# EAGLE design RxT6 (EAGLE 4.13)
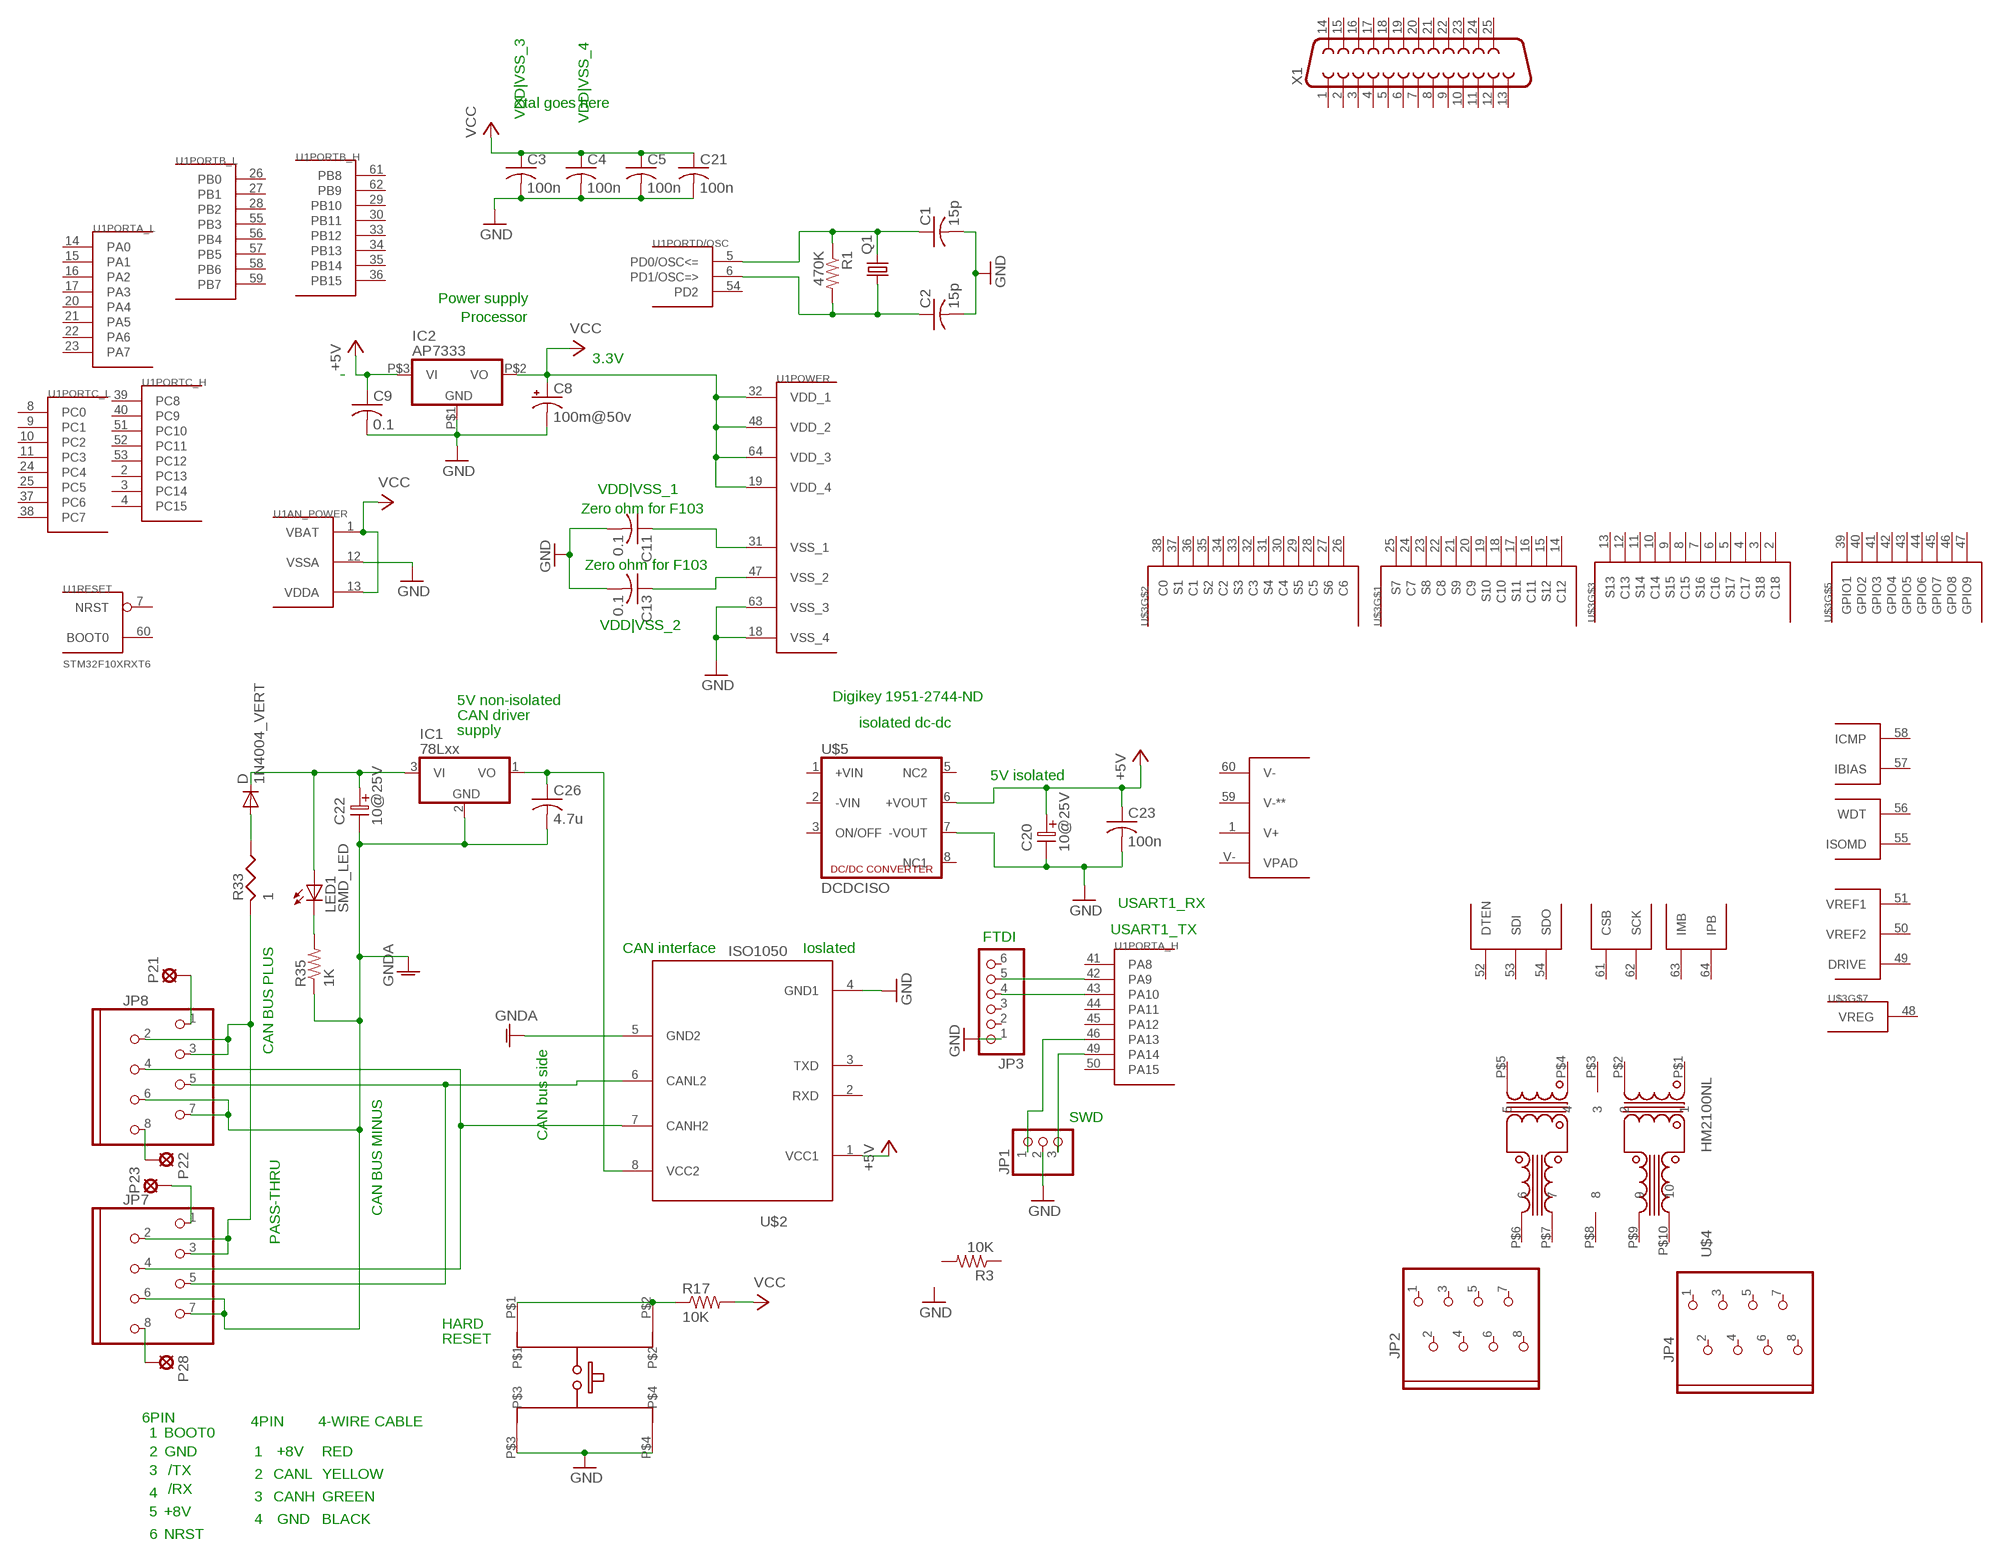
[diagram p0: schematic, sheet 1]

## Parts
C1  15p  C-USC0603  [C0603]
C2  15p  C-USC0603  [C0603]
C3  100n  C-USC0603  [C0603]
C4  100n  C-USC0603  [C0603]
C5  100n  C-USC0603  [C0603]
C8  100m@50v  CPOL-USE5-8.5  [E5-8,5]
C9  0.1  C-USC0603  [C0603]
C11  0.1  C-USC0603  [C0603]
C13  0.1  C-USC0603  [C0603]
C20  10@25V  ELC-2,5L  [ES-2,5L]
C21  100n  C-USC0603  [C0603]
C22  10@25V  ELC-2,5L  [ES-2,5L]
C23  100n  C-USC0603  [C0603]
C26  4.7u  C-USC0603  [C0603]
D  1N4004_VERT  [DO41-10_VERT]
IC1  78Lxx  7805L  [TO92]
IC2  AP7333  MCP1702  [SOT-23A]
JP1  PINHD-1X3  [1X03]
JP2  MOD8P8C  [MOD8P8C]
JP3  PINHD-1X6  [1X06]
JP4  MOD8P8C  [MOD8P8C]
JP7  MOD8P8C  [MOD8P8C]
JP8  MOD8P8C  [MOD8P8C]
LED1  SMD_LED  [SMD_LED]
P21  SOLPAD035  [SOLDPAD035]
P22  SOLPAD035  [SOLDPAD035]
P23  SOLPAD035  [SOLDPAD035]
P28  SOLPAD035  [SOLDPAD035]
Q1  CRYTALHC49S  [HC49/S]
R1  470K  R-US_R0603  [R0603]
R3  10K  R-US_R0603  [R0603]
R17  10K  R-US_R0603  [R0603]
R33  1  RESUS-S2,5  [RS-2,5]
R35  1K  R-US_R0603  [R0603]
SW1  E-SWITCH  [E-SWITCH]
U1  STM32F10XRXT6  [TQFP64]
U$2  ISO1050  [PDSO-G8]
U$3  LTC6813  [TQFP64_PAD]
U$4  HM2100NL  [PULSE]
U$5  DCDCISO  [DCDC7PIN]
X1  F25HP  [F25HP]

## Nets
+5V: C9.1 C20.1 C23.1 IC2.P$3(VI) U$2.1(VCC1) U$5.6(+VOUT)
+12V_RESISTORED: D.A R33.1
CAN_PROTECTED+: C22.1 D.C IC1.3(VI) LED1.A
CAN_RAW_PLUS: JP7.2 JP7.3 JP8.2 JP8.3 R33.2
CANCABLE_1_1: JP8.1 P21.MP
CANCABLE_1_8: JP8.8 P22.MP
CANCABLE_2_1: JP7.1 P23.MP
CANCABLE_2_8: JP7.8 P28.MP
CANH: JP7.4 JP8.4 U$2.7(CANH2)
CANL: JP7.5 JP8.5 U$2.6(CANL2)
GND: C1.2 C2.2 C3.2 C4.2 C5.2 C8.- C9.2 C11.2 C13.2 C20.2 C21.2 C23.2 IC2.P$1(GND) JP1.2 JP3.1 SW1.P$3 SW1.P$4 U1.12(AN_POWER:VSSA) U1.18(POWER:VSS_4) U1.63(POWER:VSS_3) U$2.4(GND1) U$5.7(-VOUT)
GNDA: C22.2 C26.2 IC1.2(GND) JP7.6 JP7.7 JP8.6 JP8.7 R35.1 U$2.5(GND2)
ISO_PLUS: C26.1 IC1.1(VO) U$2.8(VCC2)
JTCK: JP1.3 U1.49(PORTA_H:PA14)
JTMS: JP1.1 U1.46(PORTA_H:PA13)
LED_BUS_PWR: LED1.C R35.2
NRST: R17.1 SW1.P$1 SW1.P$2
PA9_USART1_TX: JP3.5 U1.42(PORTA_H:PA9)
PA10_USART1_RX: JP3.4 U1.43(PORTA_H:PA10)
PD0_OSC_IN_XTAL: C1.1 Q1.2 R1.1 U1.5(PORTD/OSC:PD0/OSC<=)
PD1_OSC_OUT: C2.1 Q1.1 R1.2 U1.6(PORTD/OSC:PD1/OSC=>)
VCC: C3.1 C4.1 C5.1 C8.+ C21.1 IC2.P$2(VO) R17.2 U1.1(AN_POWER:VBAT) U1.13(AN_POWER:VDDA) U1.19(POWER:VDD_4) U1.32(POWER:VDD_1) U1.48(POWER:VDD_2) U1.64(POWER:VDD_3)
VSS_1: C11.1 U1.31(POWER:VSS_1)
VSS_2: C13.1 U1.47(POWER:VSS_2)
Unconnected: JP2.1 JP2.2 JP2.3 JP2.4 JP2.5 JP2.6 JP2.7 JP2.8 JP3.2 JP3.3 JP3.6 JP4.1 JP4.2 JP4.3 JP4.4 JP4.5 JP4.6 JP4.7 JP4.8 R3.1 R3.2 U1.2(PORTC_H:PC13) U1.3(PORTC_H:PC14) U1.4(PORTC_H:PC15) U1.7(RESET:NRST) U1.8(PORTC_L:PC0) U1.9(PORTC_L:PC1) U1.10(PORTC_L:PC2) U1.11(PORTC_L:PC3) U1.14(PORTA_L:PA0) U1.15(PORTA_L:PA1) U1.16(PORTA_L:PA2) U1.17(PORTA_L:PA3) U1.20(PORTA_L:PA4) U1.21(PORTA_L:PA5) U1.22(PORTA_L:PA6) U1.23(PORTA_L:PA7) U1.24(PORTC_L:PC4) U1.25(PORTC_L:PC5) U1.26(PORTB_L:PB0) U1.27(PORTB_L:PB1) U1.28(PORTB_L:PB2) U1.29(PORTB_H:PB10) U1.30(PORTB_H:PB11) U1.33(PORTB_H:PB12) U1.34(PORTB_H:PB13) U1.35(PORTB_H:PB14) U1.36(PORTB_H:PB15) U1.37(PORTC_L:PC6) U1.38(PORTC_L:PC7) U1.39(PORTC_H:PC8) U1.40(PORTC_H:PC9) U1.41(PORTA_H:PA8) U1.44(PORTA_H:PA11) U1.45(PORTA_H:PA12) U1.50(PORTA_H:PA15) U1.51(PORTC_H:PC10) U1.52(PORTC_H:PC11) U1.53(PORTC_H:PC12) U1.54(PORTD/OSC:PD2) U1.55(PORTB_L:PB3) U1.56(PORTB_L:PB4) U1.57(PORTB_L:PB5) U1.58(PORTB_L:PB6) U1.59(PORTB_L:PB7) U1.60(RESET:BOOT0) U1.61(PORTB_H:PB8) U1.62(PORTB_H:PB9) U$2.2(RXD) U$2.3(TXD) U$3.2(C18) U$3.3(S18) U$3.4(C17) U$3.5(S17) U$3.6(C16) U$3.7(S16) U$3.8(C15) U$3.9(S15) U$3.10(C14) U$3.11(S14) U$3.12(C13) U$3.13(S13) U$3.14(C12) U$3.15(S12) U$3.16(C11) U$3.17(S11) U$3.18(C10) U$3.19(S10) U$3.20(C9) U$3.21(S9) U$3.22(C8) U$3.23(S8) U$3.24(C7) U$3.25(S7) U$3.26(C6) U$3.27(S6) U$3.28(C5) U$3.29(S5) U$3.30(C4) U$3.31(S4) U$3.32(C3) U$3.33(S3) U$3.34(C2) U$3.35(S2) U$3.36(C1) U$3.37(S1) U$3.38(C0) U$3.39(GPIO1) U$3.40(GPIO2) U$3.41(GPIO3) U$3.42(GPIO4) U$3.43(GPIO5) U$3.44(GPIO6) U$3.45(GPIO7) U$3.46(GPIO8) U$3.47(GPIO9) U$3.48(VREG) U$3.55(ISOMD) U$3.56(WDT) U$3.57(IBIAS) U$3.58(ICMP) U$3.61(CSB) U$3.62(SCK) U$3.63(IMB) U$3.64(IPB) U$4.P$1 U$4.P$2 U$4.P$3 U$4.P$4 U$4.P$5 U$4.P$6 U$4.P$7 U$4.P$8 U$4.P$9 U$4.P$10 U$5.1(+VIN) U$5.2(-VIN) U$5.3(ON/OFF) U$5.5(NC2) U$5.8(NC1) X1.1 X1.2 X1.3 X1.4 X1.5 X1.6 X1.7 X1.8 X1.9 X1.10 X1.11 X1.12 X1.13 X1.14 X1.15 X1.16 X1.17 X1.18 X1.19 X1.20 X1.21 X1.22 X1.23 X1.24 X1.25

## Notes on the sheet
- Xtal goes here
- VDD|VSS_3 | VDD|VSS_4
- Power supply
- Processor
- 3.3V
- VDD|VSS_1
- Zero ohm for F103
- Zero ohm for F103
- VDD|VSS_2
- 5V non-isolated | Digikey | 1951-2744-ND
- CAN driver
- isolated dc-dc
- supply
- 5V isolated
- USART1_RX
- USART1_TX
- FTDI
- CAN interface | Ioslated
- CAN BUS PLUS
- SWD
- CAN bus side
- PASS-THRU
- CAN BUS MINUS
- HARD
- RESET
- 6PIN | 4PIN | 4-WIRE CABLE
- 1 | BOOT0
- 2 | GND | 1 | +8V | RED
- 3 | /TX | 2 | CANL | YELLOW
- 4 | /RX
- 3 | CANH | GREEN
- 5 | +8V
- 4 | GND | BLACK
- 6 | NRST

## Power pins joined to a net without a drawn wire
DRIVE: U$3.49(DRIVE)
DTEN: U$3.52(DTEN)
SDI: U$3.53(SDI)
SDO: U$3.54(SDO)
V+: U$3.1(V+)
V-: U$3.60(V-)
V-**: U$3.59(V-**)
VPAD: U$3.V-(VPAD)
VREF1: U$3.51(VREF1)
VREF2: U$3.50(VREF2)

## Library data of the parts
C1-C5 C9 C11 C13 C21 C23 C26 = rcl:C-US: CAPACITOR, American symbol
C8 = rcl:CPOL-US: POLARIZED CAPACITOR, American symbol
C20 C22 = DEH:ELC-2,5L
D = diode:1N4004_VERT
IC1 = linear:78*: Positive VOLTAGE REGULATOR
IC2 = linear:MCP1702
JP1 = pinhead:PINHD-1X3: PIN HEADER
JP2 JP4 JP7 JP8 = DEH:MOD8P8C
JP3 = pinhead:PINHD-1X6: PIN HEADER
LED1 = led:SMD_LED
P21-P23 P28 = solpad:SOLPAD035
Q1 = crystal:CRYTAL: CRYSTAL
R1 R3 R17 R35 = rcl:R-US_: RESISTOR, American symbol
R33 = DEH:RESUS-S2,5
SW1 = switch-misc:E-SWITCH
U1 = stm32:STM32F10XRXT6: STM32F101/103 64pin LQFP
U$2 = texas:ISO1050
U$3 = stm32:LTC6813
U$4 = DEH:HM2100NL
U$5 = dc-dc-converter:DCDCISO
X1 = con-subd:F25: SUB-D

## Board
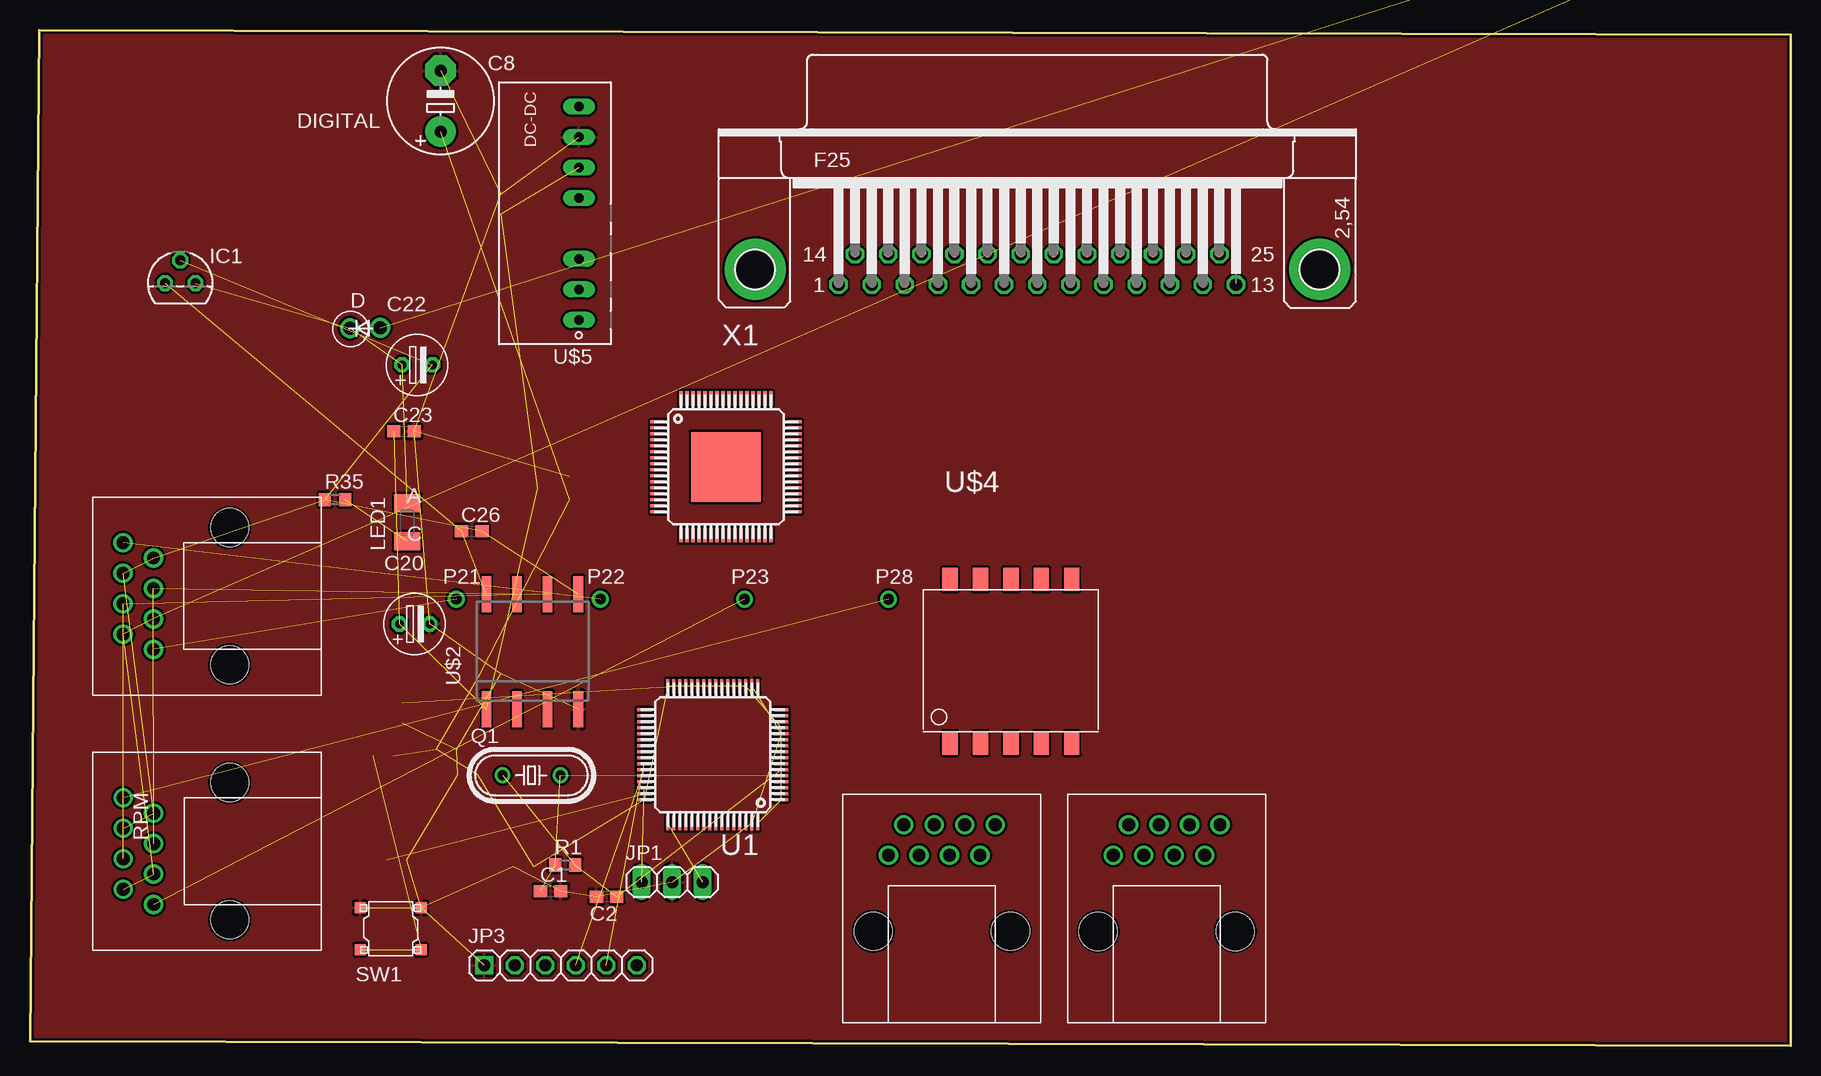
[diagram p1: board, top side]
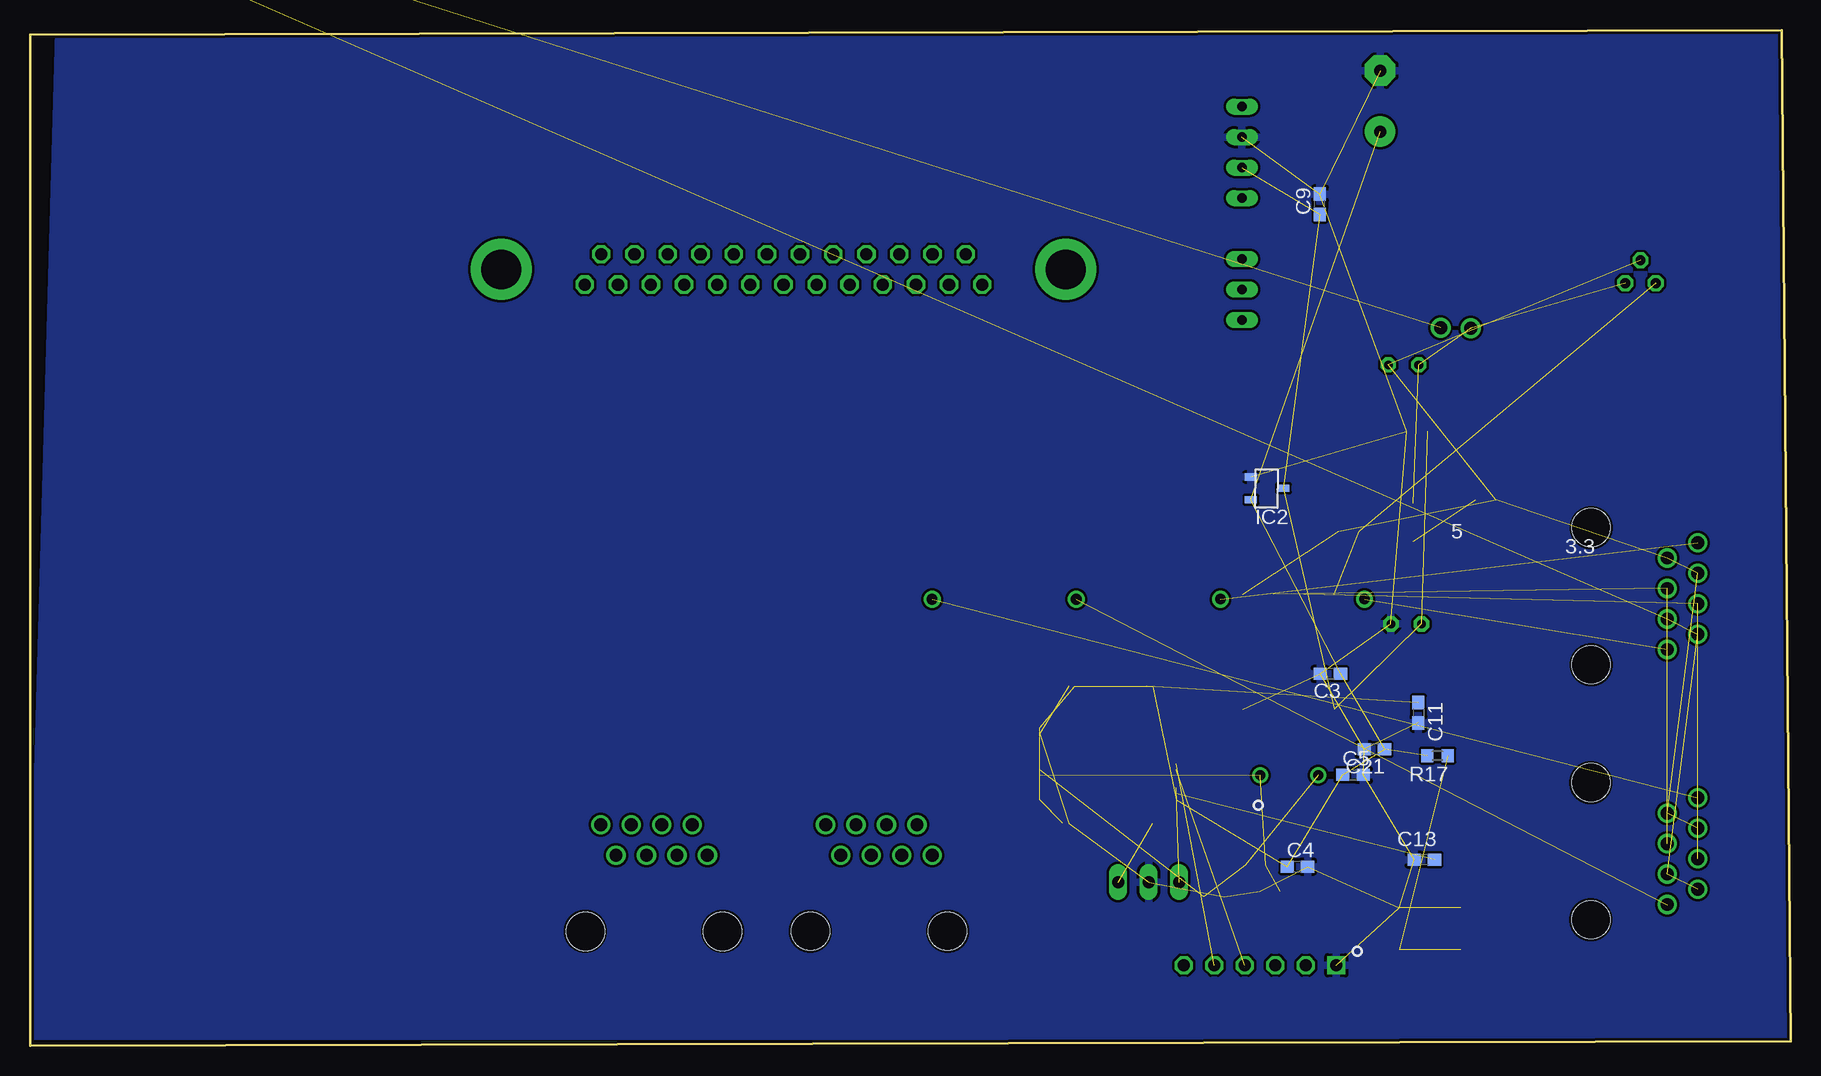
[diagram p2: board, bottom side, seen from below]

Size 146.73 x 84.66 mm. Coordinates in mm from the lower left corner, seen from the top.
Outline: 0,0.38 0.76,84.66 146.73,84.28 146.73,0 0,0.38
Copper layers (1*16): Top 0.035mm / dielectric 1.5mm / Bottom 0.035mm
Design rules "default": minimum track width 8mil, minimum drill 0.6mm, track to track 0.2083mm, track to pad 8mil, pad to pad 8mil, via to via 8mil, smd to smd 0mil, copper to edge 8mil, drill to drill 8mil, minimum pad ring 10mil, minimum via ring 8mil, stop-mask expansion 4mil, vias tented up to drill 0mil, thermal gap 10mil

### Footprints (pad centres in the part's own frame; a part is rotated, then mirrored left to right if it is on the bottom)
C0603 = smd 1.1 x 1: 1 -0.85,0; 2 0.85,0
E5-8,5 = drill 1 pad 2.54 round: + -2.54,0 | drill 1 pad 2.54 octagon: - 2.54,0
ES-2,5L = drill 0.711 pad 1.27 octagon: 1 0,0; 2 2.54,0
DO41-10_VERT = drill 1.1 round: A 2.58,0.05; C 0.07,0
TO92 = drill 0.813 octagon: 1 -1.27,0; 2 0,1.905; 3 1.27,0
SOT-23A = smd 0.6 x 1: P$1 -0.95,-1.35; P$2 0.95,-1.35; P$3 0,1.35
1X03 = drill 1 long: 1 -2.54,0; 2 0,0; 3 2.54,0
MOD8P8C = drill 1.067 pad 1.397 round: 1 -3.81,-2.54; 2 -2.54,0; 3 -1.27,-2.54; 4 0,0; 5 1.27,-2.54; 6 2.54,0; 7 3.81,-2.54; 8 5.08,0 | hole 3.175: -5.08,-8.89; 6.35,-8.89
1X06 = drill 1 square: 1 -6.35,0 | drill 1 octagon: 2 -3.81,0; 3 -1.27,0; 4 1.27,0; 5 3.81,0; 6 6.35,0
SMD_LED = smd 2.2 x 1.5: A 0,1.6; C 0,-1.6
SOLDPAD035 = drill 0.889 pad 1.27 round: MP 0,0
HC49/S = drill 0.813 round: 1 -2.413,0; 2 2.413,0
R0603 = smd 1 x 1.1: 1 -0.85,0; 2 0.85,0
RS-2,5 = drill 0.9 pad 1.6 octagon: 1 0,0; 2 2.54,0
E-SWITCH = smd 0.9 x 0.9: P$1 -2.55,1.75; P$2 2.55,1.75; P$3 -2.55,-1.75; P$4 2.55,-1.75
TQFP64 = smd 1.2 x 0.26: 1 -5.7,3.75; 2 -5.7,3.25; 3 -5.7,2.75; 4 -5.7,2.25; 5 -5.7,1.75; 6 -5.7,1.25; 7 -5.7,0.75; 8 -5.7,0.25; 9 -5.7,-0.25; 10 -5.7,-0.75; 11 -5.7,-1.25; 12 -5.7,-1.75; 13 -5.7,-2.25; 14 -5.7,-2.75; 15 -5.7,-3.25; 16 -5.7,-3.75; 33 5.7,-3.75; 34 5.7,-3.25; 35 5.7,-2.75; 36 5.7,-2.25; 37 5.7,-1.75; 38 5.7,-1.25; 39 5.7,-0.75; 40 5.7,-0.25; 41 5.7,0.25; 42 5.7,0.75; 43 5.7,1.25; 44 5.7,1.75; 45 5.7,2.25; 46 5.7,2.75; 47 5.7,3.25; 48 5.7,3.75 | smd 0.26 x 1.2: 17 -3.75,-5.7; 18 -3.25,-5.7; 19 -2.75,-5.7; 20 -2.25,-5.7; 21 -1.75,-5.7; 22 -1.25,-5.7; 23 -0.75,-5.7; 24 -0.25,-5.7; 25 0.25,-5.7; 26 0.75,-5.7; 27 1.25,-5.7; 28 1.75,-5.7; 29 2.25,-5.7; 30 2.75,-5.7; 31 3.25,-5.7; 32 3.75,-5.7; 49 3.75,5.7; 50 3.25,5.7; 51 2.75,5.7; 52 2.25,5.7; 53 1.75,5.7; 54 1.25,5.7; 55 0.75,5.7; 56 0.25,5.7; 57 -0.25,5.7; 58 -0.75,5.7; 59 -1.25,5.7; 60 -1.75,5.7; 61 -2.25,5.7; 62 -2.75,5.7; 63 -3.25,5.7; 64 -3.75,5.7
PDSO-G8 = smd 0.8 x 3: 1 -3.825,-4.8; 2 -1.275,-4.8; 3 1.265,-4.78; 4 3.825,-4.8; 5 3.825,4.8; 6 1.275,4.8; 7 -1.275,4.81; 8 -3.825,4.81
TQFP64_PAD = smd 1.2 x 0.26: 1 -5.7,3.75; 2 -5.7,3.25; 3 -5.7,2.75; 4 -5.7,2.25; 5 -5.7,1.75; 6 -5.7,1.25; 7 -5.7,0.75; 8 -5.7,0.25; 9 -5.7,-0.25; 10 -5.7,-0.75; 11 -5.7,-1.25; 12 -5.7,-1.75; 13 -5.7,-2.25; 14 -5.7,-2.75; 15 -5.7,-3.25; 16 -5.7,-3.75; 33 5.7,-3.75; 34 5.7,-3.25; 35 5.7,-2.75; 36 5.7,-2.25; 37 5.7,-1.75; 38 5.7,-1.25; 39 5.7,-0.75; 40 5.7,-0.25; 41 5.7,0.25; 42 5.7,0.75; 43 5.7,1.25; 44 5.7,1.75; 45 5.7,2.25; 46 5.7,2.75; 47 5.7,3.25; 48 5.7,3.75 | smd 0.26 x 1.2: 17 -3.75,-5.7; 18 -3.25,-5.7; 19 -2.75,-5.7; 20 -2.25,-5.7; 21 -1.75,-5.7; 22 -1.25,-5.7; 23 -0.75,-5.7; 24 -0.25,-5.7; 25 0.25,-5.7; 26 0.75,-5.7; 27 1.25,-5.7; 28 1.75,-5.7; 29 2.25,-5.7; 30 2.75,-5.7; 31 3.25,-5.7; 32 3.75,-5.7; 49 3.75,5.7; 50 3.25,5.7; 51 2.75,5.7; 52 2.25,5.7; 53 1.75,5.7; 54 1.25,5.7; 55 0.75,5.7; 56 0.25,5.7; 57 -0.25,5.7; 58 -0.75,5.7; 59 -1.25,5.7; 60 -1.75,5.7; 61 -2.25,5.7; 62 -2.75,5.7; 63 -3.25,5.7; 64 -3.75,5.7 | smd 5.8 x 5.8: V- 0,0
PULSE = smd 1.27 x 1.9: P$1 -5.08,-6.78; P$2 -2.54,-6.78; P$3 0,-6.78; P$4 2.54,-6.78; P$5 5.08,-6.78; P$6 5.08,6.88; P$7 2.54,6.88; P$8 0,6.88; P$9 -2.54,6.88; P$10 -5.08,6.88
DCDC7PIN = drill 0.813 long: 1 0,-0.03; 2 2.54,-0.03; 3 5.08,-0.03; 5 10.16,-0.03; 6 12.7,-0.03; 7 15.24,-0.03; 8 17.78,-0.03
F25HP = drill 1.016 octagon: 1 -16.561,-1.27; 2 -13.792,-1.27; 3 -11.049,-1.27; 4 -8.28,-1.27; 5 -5.512,-1.27; 6 -2.769,-1.27; 7 0,-1.27; 8 2.769,-1.27; 9 5.512,-1.27; 10 8.28,-1.27; 11 11.049,-1.27; 12 13.792,-1.27; 13 16.561,-1.27; 14 -15.189,1.27; 15 -12.421,1.27; 16 -9.652,1.27; 17 -6.909,1.27; 18 -4.14,1.27; 19 -1.372,1.27; 20 1.372,1.27; 21 4.14,1.27; 22 6.909,1.27; 23 9.652,1.27; 24 12.421,1.27; 25 15.189,1.27 | drill 3.302 pad 5.08 round: G1 -23.52,0; G2 23.52,0

### Placement (x,y rotation side)
C1  43.39,12.89 0 top
C2  48.05,12.44 180 top
C3  38.37,31 180 bottom
C4  41.12,14.95 0 bottom
C5  36.48,22.58 0 bottom
C8  34.21,78.74 90 top
C9  39.24,70.14 90 bottom
C11  31.03,27.77 270 bottom
C13  30.54,15.53 180 bottom
C20  30.78,35.17 0 top
C21  34.7,24.72 180 bottom
C22  31,56.76 0 top
C23  31.16,51.21 0 top
C26  36.81,42.88 0 top
D  26.6,59.8 0 top
IC1  12.52,63.56 0 top
IC2  43.63,46.47 270 bottom
JP1  53.51,13.65 0 top
JP2  94.09,18.43 0 top
JP3  44.22,6.72 0 top
JP4  75.35,18.44 0 top
JP7  7.76,15.59 90 top
JP8  7.75,36.85 90 top
LED1  31.44,43.64 0 top
P21  35.52,37.23 0 top
P22  47.53,37.23 0 top
P23  59.54,37.22 0 top
P28  71.55,37.22 0 top
Q1  41.79,22.55 0 top
R1  44.6,15.07 0 top
R3  52.64,92.11 0 top  (outside the outline)
R17  29.43,24.19 180 bottom
R33  155.38,100.09 0 top  (outside the outline)
R35  25.42,45.52 0 top
SW1  30.06,9.76 180 top
U1  56.9,24.27 180 top
U$2  41.86,32.84 0 top
U$3  58,48.26 0 top
U$4  81.74,32 0 top
U$5  45.71,60.5 90 top
X1  83.94,64.71 0 top

### Tracks (layer width: path | path; a pad name or v marks a point on that pad's centre or on a via)
+5V  (5 unrouted)
+12V_RESISTORED  (1 unrouted)
CAN_PROTECTED+  (3 unrouted)
CAN_RAW_PLUS  (4 unrouted)
CANCABLE_1_1  (1 unrouted)
CANCABLE_1_8  (1 unrouted)
CANCABLE_2_1  (1 unrouted)
CANCABLE_2_8  (1 unrouted)
CANH  (2 unrouted)
CANL  (2 unrouted)
GND  (21 unrouted)
  pour Bottom (rank 4): 143.84,102.29 146.71,0.81 0.62,0.71 0.62,0.89 1.38,104.02
  pour Top (rank 5): 0.2,0.42 146.32,0.04 147.69,102.49 1.41,102.88
GNDA  (8 unrouted)
ISO_PLUS  (2 unrouted)
JTCK  (1 unrouted)
JTMS  (1 unrouted)
LED_BUS_PWR  (1 unrouted)
NRST  (2 unrouted)
PA9_USART1_TX  (1 unrouted)
PA10_USART1_RX  (1 unrouted)
PD0_OSC_IN_XTAL  (3 unrouted)
PD1_OSC_OUT  (3 unrouted)
VCC  (12 unrouted)
VSS_1  (1 unrouted)
VSS_2  (1 unrouted)

### Text on the board
tNames: 3.3V | ANALOG | DIGITAL | RPM
bNames: 3.2 | 5 | 5 | 3.3
tValues: 3.3V | DIGITAL | +5V | 3.2v | ANALOG | 3.2